# EAGLE schematic MC Breakout-F4 & Power (EAGLE 6.5.0)
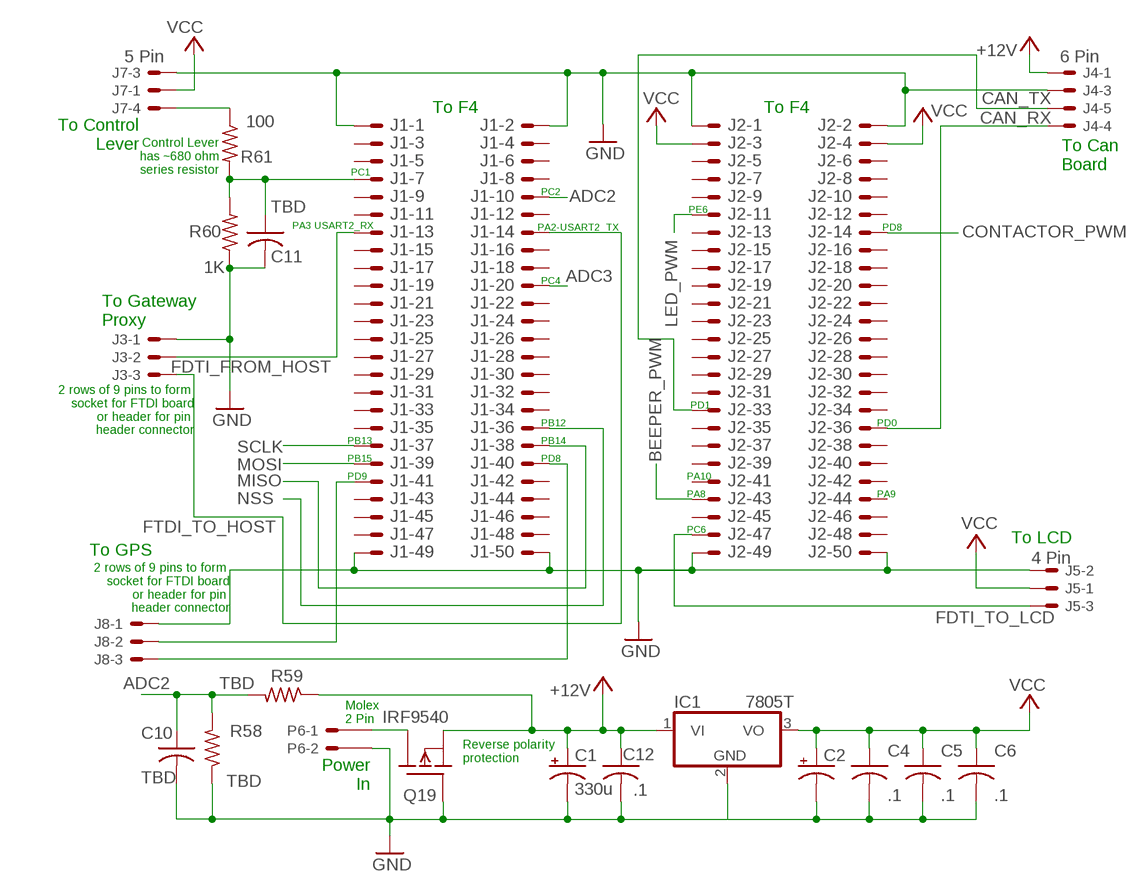
[diagram p0: schematic, sheet 1]

## Parts
C1  330u  CPOL-USE2-5  [E2-5]
C2  CPOL-USE2-5  [E2-5]
C4  .1  SMT0805  [SMT0805]
C5  .1  SMT0805  [SMT0805]
C6  .1  SMT0805  [SMT0805]
C10  TBD  SMT0805  [SMT0805]
C11  TBD  SMT0805  [SMT0805]
C12  .1  SMT0805  [SMT0805]
IC1  7805T  [TO220H]
J1  1365-50  [1365-50]
J2  1365-50  [1365-50]
J3  22-23-2041  [22-23-2041]
J4  6 Pin  22-23-2061  [22-23-2061]
J5  4 Pin  22-23-2051  [22-23-2051]
J7  5 Pin  22-23-2051  [22-23-2051]
J8  22-23-2041  [22-23-2041]
P6  43160-3102  [43160-XX02]
Q19  IRF9540  IRF9530  [TO220]
R58  TBD  R-US_V234/12  [V234/12]
R59  TBD  R-US_V234/12  [V234/12]
R60  1K  R-US_V234/12  [V234/12]
R61  100  R-US_V234/12  [V234/12]

## Nets
+5V: C1.+ C12.P$1 IC1.1(VI) J4.1 Q19.3(S) R59.1 ; supply symbol labelled +12V
ADC2: C10.P$1 J1.10 R58.2 R59.2
ADC3: J1.20
ADC_1: C11.P$1 J1.7 R60.2 R61.2
BEEPER_PWM: J2.43
CAN_RX: J2.36 J4.4
CAN_TX: J2.33 J4.5
CONTACTOR_PWM: J2.14
CONTROL_LEVER: J7.4 R61.1
FDTI_FROM_HOST: J3.3
FDTI_FROM_HOST1: J1.40 J8.3
FDTI_TO_LCD: J2.47 J5.3
FLYBACK_RTN: P6.1@1(-1:S) Q19.2(D)
FTDI_TO_HOST: J3.2
FTDI_TO_HOST1: J1.41 J8.2
GND: C1.- C2.- C4.P$2 C5.P$2 C6.P$2 C10.P$2 C11.P$2 C12.P$2 IC1.2(GND) J1.1 J1.2 J1.49 J1.50 J2.1 J2.2 J2.49 J2.50 J3.1 J4.3 J5.2 J7.3 J8.1 P6.2@1(-2:S) Q19.1(G) R58.1 R60.1
LED_PWM: J2.11
MISO: J1.38
MOSI: J1.39
NSS: J1.36
SCLK: J1.37
VCC: C2.+ C4.P$1 C5.P$1 C6.P$1 IC1.3(VO) J2.3 J2.4 J5.1 J7.1
Unconnected: J1.3 J1.4 J1.5 J1.6 J1.8 J1.9 J1.11 J1.12 J1.13 J1.14 J1.15 J1.16 J1.17 J1.18 J1.19 J1.21 J1.22 J1.23 J1.24 J1.25 J1.26 J1.27 J1.28 J1.29 J1.30 J1.31 J1.32 J1.33 J1.34 J1.35 J1.42 J1.43 J1.44 J1.45 J1.46 J1.47 J1.48 J2.5 J2.6 J2.7 J2.8 J2.9 J2.10 J2.12 J2.13 J2.15 J2.16 J2.17 J2.18 J2.19 J2.20 J2.21 J2.22 J2.23 J2.24 J2.25 J2.26 J2.27 J2.28 J2.29 J2.30 J2.31 J2.32 J2.34 J2.35 J2.37 J2.38 J2.39 J2.40 J2.41 J2.42 J2.44 J2.45 J2.46 J2.48 J3.4 J4.2 J4.6 J5.4 J5.5 J7.2 J7.5 J8.4 P6.1@2(-1:S) P6.2@2(-2:S)

## Notes on the sheet
- To F4
- To F4
- To Control
  Lever
- To Can
  Board
- Control Lever
  has ~680 ohm
  series resistor
- PC1
- PC2
- PE6
- PA3 USART2_RX | PA2-USART2_TX | PD8
- PC4
- To Gateway
  Proxy
- 2 rows of 9 pins to form 
  socket for FTDI board
  or header for pin 
  header connector
- PD1
- PB12 | PD0
- PB13 | PB14
- PB15 | PD8
- PD9 | PA10
- PA8 | PA9
- PC6 | To LCD
- To GPS
- 2 rows of 9 pins to form 
  socket for FTDI board
  or header for pin 
  header connector
- Molex
  2 Pin
- Power
  In
- Reverse polarity
  protection

## Library data of the parts
C1 C2 = resistor:CPOL-US: POLARIZED CAPACITOR, American symbol
C4-C6 C10-C12 = deh:SMT0805
IC1 = linear:78*: Positive VOLTAGE REGULATOR Source: http://cache.national.com/ds/LM/LM78L05.pdf http://www.fairchildsemi.com/ds/LM/LM7805.pdf
J1 J2 = con-leotronics:1365-50: DUAL ROW STRAIGHT HEADER 1364 SERIES. 1.27mm x 1.27mm. Without Fixing Post. SMT Source: http://www.leotronics.co.uk/Conexcon/Data%20Sheets/sec.%20A/1364ing.pdf; OC_FARNELL: unknown; OC_NEWARK: unknown
J3 J8 = con-molex:22-23-2041: .100" (2.54mm) Center Header - 4 Pin; MF: MOLEX; MPN: 22-23-2041; OC_FARNELL: 1462920; OC_NEWARK: 38C0355
J4 = con-molex:22-23-2061: .100" (2.54mm) Center Header - 6 Pin; MF: MOLEX; MPN: 22-23-2061; OC_FARNELL: 1462922; OC_NEWARK: 27C1933
J5 J7 = con-molex:22-23-2051: .100" (2.54mm) Center Header - 5 Pin; MF: MOLEX; MPN: 22-23-2051; OC_FARNELL: 1462952; OC_NEWARK: 38C9178
P6 = con-molex:43160-*02: SDA-43160 Connector Source: http://www.molex.com/pdm_docs/sd/431601306_sd.pdf; MF: WALDOM/MOLEX; MPN: 43160-3102; OC_FARNELL: 3293038; OC_NEWARK: 54H0264
Q19 = transistor-fet:IRF9530: P-Channel Enhancement MOSFET (HEXFET); -100V; -12A; 0,3Ohm
R58-R61 = resistor:R-US_: RESISTOR, American symbol